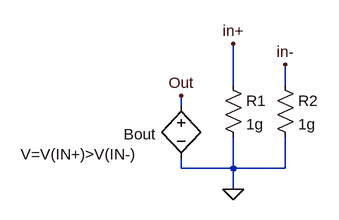
[diagram p0: schematic Comparator.asc]
Comparator.asc, the LTspice schematic file:
Version 4
SHEET 1 880 680
WIRE 320 192 320 128
WIRE 400 192 400 160
WIRE 240 224 240 208
WIRE 240 320 240 304
WIRE 320 320 320 272
WIRE 320 320 240 320
WIRE 400 320 400 272
WIRE 400 320 320 320
WIRE 320 352 320 320
FLAG 240 208 Out
FLAG 320 128 in+
FLAG 400 160 in-
FLAG 320 352 0
SYMBOL bv 240 208 R0
WINDOW 3 -247 90 Left 2
WINDOW 0 -39 59 Right 2
SYMATTR Value V=V(IN+)>V(IN-)
SYMATTR InstName Bout
SYMBOL res 304 176 R0
SYMATTR InstName R1
SYMATTR Value 1g
SYMBOL res 384 176 R0
SYMATTR InstName R2
SYMATTR Value 1g

The netlist it stands for:
* Comparator.asc
Bout Out 0 V=V(IN+)>V(IN-)
R1 in+ 0 1g
R2 in- 0 1g
.backanno
.end